# Altium schematic sheet Digital Inputs.SchDoc: Ravage - Digital Inputs
size A4; Address1: Drawn By:; Address2: Dan Visser; DocumentNumber: A; Revision: 0.1-alpha; SheetNumber: 8; SheetTotal: 16
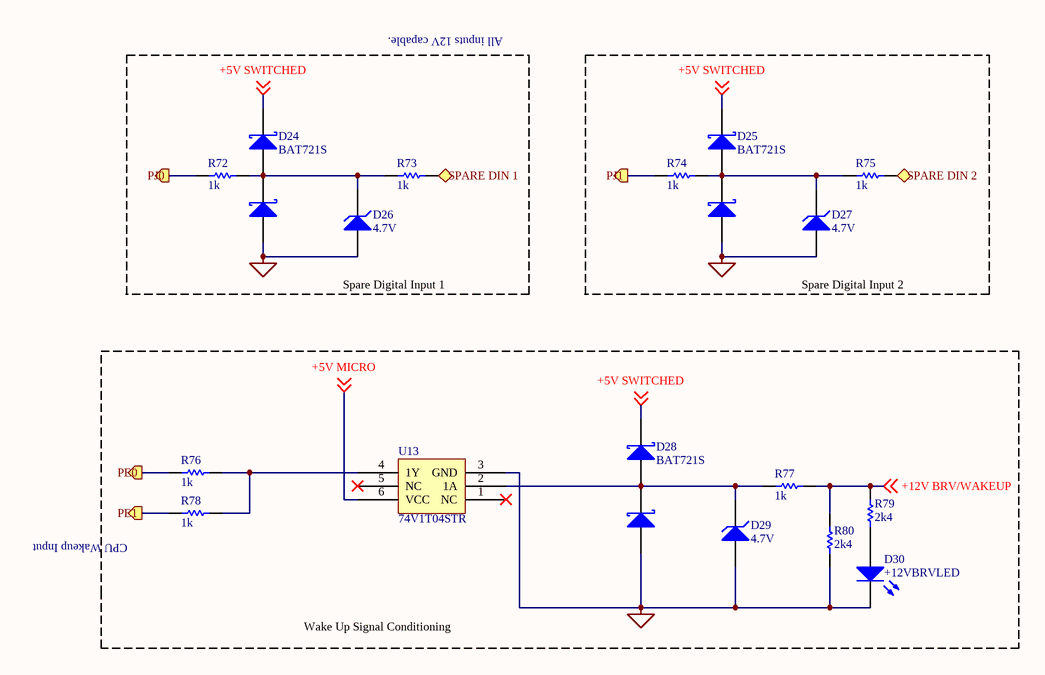
[diagram p0: Digital Inputs.SchDoc]

## Parts
D24  BAT721S
D25  BAT721S
D26  4.7V  [DIODE-0.7]
D27  4.7V  [DIODE-0.7]
D28  BAT721S
D29  4.7V  [DIODE-0.7]
D30  +12VBRVLED  [LED-0]
R72  value 1k  [AXIAL-0.3]
R73  value 1k  [AXIAL-0.3]
R74  value 1k  [AXIAL-0.3]
R75  value 1k  [AXIAL-0.3]
R76  value 1k  [AXIAL-0.3]
R77  value 1k  [AXIAL-0.3]
R78  value 1k  [AXIAL-0.3]
R79  value 2k4  [AXIAL-0.3]
R80  value 2k4  [AXIAL-0.3]
U13  74V1T04STR

## Blocks framed on the sheet
Spare Digital Input 1: D24 D26 R72 R73
Spare Digital Input 2: D25 D27 R74 R75

## Ports
PE0 (out), PE1 (out), PJ0 (out), PJ1 (out), SPARE DIN 1 (in), SPARE DIN 2 (in)

## Nets
NetD24_1: D24.1(A) D25.1(A) D26.1(A) D27.1(A) D28.1(A) D29.1(A) D30.2(K) R80.1 U13.3(GND)
+5V MICRO: U13.6(VCC) ; off-sheet +5V MICRO
+5V SWITCHED: D24.2(K) D25.2(K) D28.2(K) ; off-sheet +5V SWITCHED
+12V BRV/WAKEUP: R77.2 R79.2 R80.2 ; off-sheet +12V BRV/WAKEUP
PE0: R76.2 ; port PE0
PE1: R78.2 ; port PE1
PJ0: R72.2 ; port PJ0
PJ1: R74.2 ; port PJ1
SPARE DIN 1: R73.2 ; port SPARE DIN 1
SPARE DIN 2: R75.2 ; port SPARE DIN 2
NetD24_3: D24.3(A2) D26.2(K) R72.1 R73.1
NetD25_3: D25.3(A2) D27.2(K) R74.1 R75.1
NetD28_3: D28.3(A2) D29.2(K) R77.1 U13.2(1A)
NetD30_1: D30.1(A) R79.1
NetR76_1: R76.1 R78.1 U13.4(1Y)

Not connected (* = marked no-connect by the designer): U13 1(NC)* 5(NC)*

## Notes on the sheet
- All inputs 12V capable.
- (near R78) CPU Wakeup Input
- Wake Up Signal Conditioning
- Title
- Size:
- Date:
- A4
- Number:
- Time:
- Revision:
- Sheet
- of

## Library data of the parts
D24 D25 D28 = BAT721S: DUAL SCHOTTKY DIODE
D26 D27 D29 = D Zener: Zener Diode; Published: 8-Jun-2000; LatestRevisionDate: 17-Jul-2002; LatestRevisionNote: Re-released for DXP Platform.; PackageReference: DIODE-0.7; Publisher: Altium Limited; PackageDescription: Diode, Thru-Hole; 2 Leads; 0.7 in Pin Spacing
D30 = LED0: Typical INFRARED GaAs LED; Published: 8-Jun-2000; LatestRevisionDate: 08-Jul-2005; LatestRevisionNote: Mech Layer 1 removed.; PackageReference: LED-0; Publisher: Altium Limited; PackageDescription: LED; 2 Leads
R72-R80 = Res1: Resistor; Published: 8-Jun-2000; LatestRevisionDate: 17-Jul-2002; LatestRevisionNote: Re-released for DXP Platform.; PackageReference: AXIAL-0.3; Publisher: Altium Limited; PackageDescription: Axial Device, Thru-Hole; 2 Leads; 0.3 in Pin Spacing